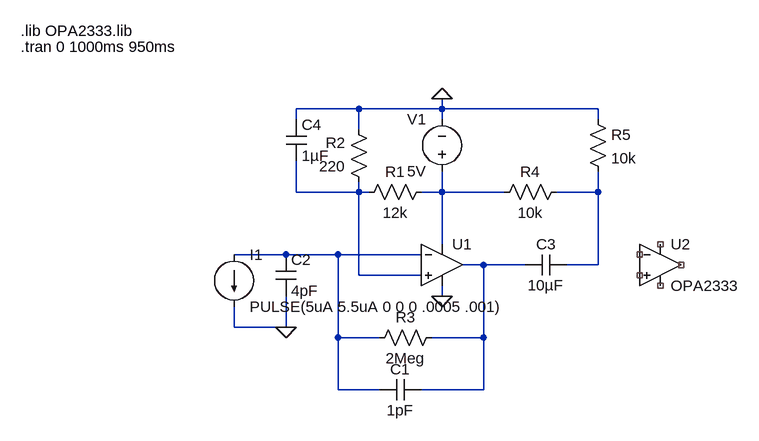
[diagram p0: schematic LogicBoard.asc]
LogicBoard.asc, the LTspice schematic file:
Version 4.1
SHEET 1 880 680
WIRE 144 -208 48 -208
WIRE 272 -208 272 -224
WIRE 272 -208 144 -208
WIRE 512 -208 272 -208
WIRE 48 -192 48 -208
WIRE 272 -192 272 -208
WIRE 512 -192 512 -208
WIRE 144 -176 144 -208
WIRE 48 -80 48 -128
WIRE 144 -80 144 -96
WIRE 144 -80 48 -80
WIRE 160 -80 144 -80
WIRE 272 -80 272 -112
WIRE 272 -80 240 -80
WIRE 368 -80 272 -80
WIRE 512 -80 512 -112
WIRE 512 -80 448 -80
WIRE 272 0 272 -80
WIRE 32 16 -48 16
WIRE 112 16 32 16
WIRE 240 16 112 16
WIRE 336 32 304 32
WIRE 400 32 336 32
WIRE 512 32 512 -80
WIRE 512 32 464 32
WIRE 144 48 144 -80
WIRE 240 48 144 48
WIRE 272 80 272 64
WIRE -48 128 -48 96
WIRE 32 128 32 80
WIRE 32 128 -48 128
WIRE 112 144 112 16
WIRE 176 144 112 144
WIRE 336 144 336 32
WIRE 336 144 256 144
WIRE 112 224 112 144
WIRE 176 224 112 224
WIRE 336 224 336 144
WIRE 336 224 240 224
FLAG 32 128 0
FLAG 272 80 0
FLAG 272 -224 0
SYMBOL current -48 16 R0
WINDOW 123 0 0 Left 0
WINDOW 39 0 0 Left 0
SYMATTR InstName I1
SYMATTR Value PULSE(5uA 5.5uA 0 0 0 .0005 .001)
SYMBOL cap 16 16 R0
SYMATTR InstName C2
SYMATTR Value 4pF
SYMBOL res 272 128 R90
WINDOW 0 0 56 VBottom 2
WINDOW 3 32 56 VTop 2
SYMATTR InstName R3
SYMATTR Value 2Meg
SYMBOL cap 240 208 R90
WINDOW 0 0 32 VBottom 2
WINDOW 3 32 32 VTop 2
SYMATTR InstName C1
SYMATTR Value 1pF
SYMBOL voltage 272 -96 R180
WINDOW 0 24 96 Left 2
WINDOW 3 24 16 Left 2
WINDOW 123 0 0 Left 0
WINDOW 39 0 0 Left 0
SYMATTR InstName V1
SYMATTR Value 5V
SYMBOL res 256 -96 R90
WINDOW 0 0 56 VBottom 2
WINDOW 3 32 56 VTop 2
SYMATTR InstName R1
SYMATTR Value 12k
SYMBOL res 160 -80 R180
WINDOW 0 36 76 Left 2
WINDOW 3 36 40 Left 2
SYMATTR InstName R2
SYMATTR Value 220
SYMBOL cap 464 16 R90
WINDOW 0 0 32 VBottom 2
WINDOW 3 32 32 VTop 2
SYMATTR InstName C3
SYMATTR Value 10µF
SYMBOL OpAmps\\opamp2 608 -32 R0
SYMATTR InstName U2
SYMATTR Value OPA2333
SYMBOL res 496 -208 R0
SYMATTR InstName R5
SYMATTR Value 10k
SYMBOL res 464 -96 R90
WINDOW 0 0 56 VBottom 2
WINDOW 3 32 56 VTop 2
SYMATTR InstName R4
SYMATTR Value 10k
SYMBOL cap 32 -192 R0
SYMATTR InstName C4
SYMATTR Value 1µF
SYMBOL OpAmps\\UniversalOpAmp1 272 32 R0
SYMATTR InstName U1
TEXT -376 -328 Left 2 !.lib OPA2333.lib
TEXT -376 -304 Left 2 !.tran 0 1000ms 950ms

The netlist it stands for:
* LogicBoard.asc
I1 N004 0 PULSE(5uA 5.5uA 0 0 0 .0005 .001)
C2 N004 0 4pF
R3 N005 N004 2Meg
C1 N005 N004 1pF
V1 N002 0 5V
R1 N002 N001 12k
R2 N001 0 220
C3 N003 N005 10µF
X§U2 NC_01 NC_02 NC_03 NC_04 NC_05 OPA2333  ; pins In+ In- V+ V- OUT
R5 0 N003 10k
R4 N003 N002 10k
C4 0 N001 1µF
X§U1 N001 N004 N002 0 N005 level1 Avol=1Meg GBW=10Meg Vos=0 En=0 Enk=0 In=0 Ink=0 Rin=500Meg  ; pins In+ In- V+ V- OUT
.lib OPA2333.lib
.tran 0 1000ms 950ms
.lib UniversalOpAmp1.lib
.backanno
.end